# Altium project PCB_Project_GateWay.PrjPcb
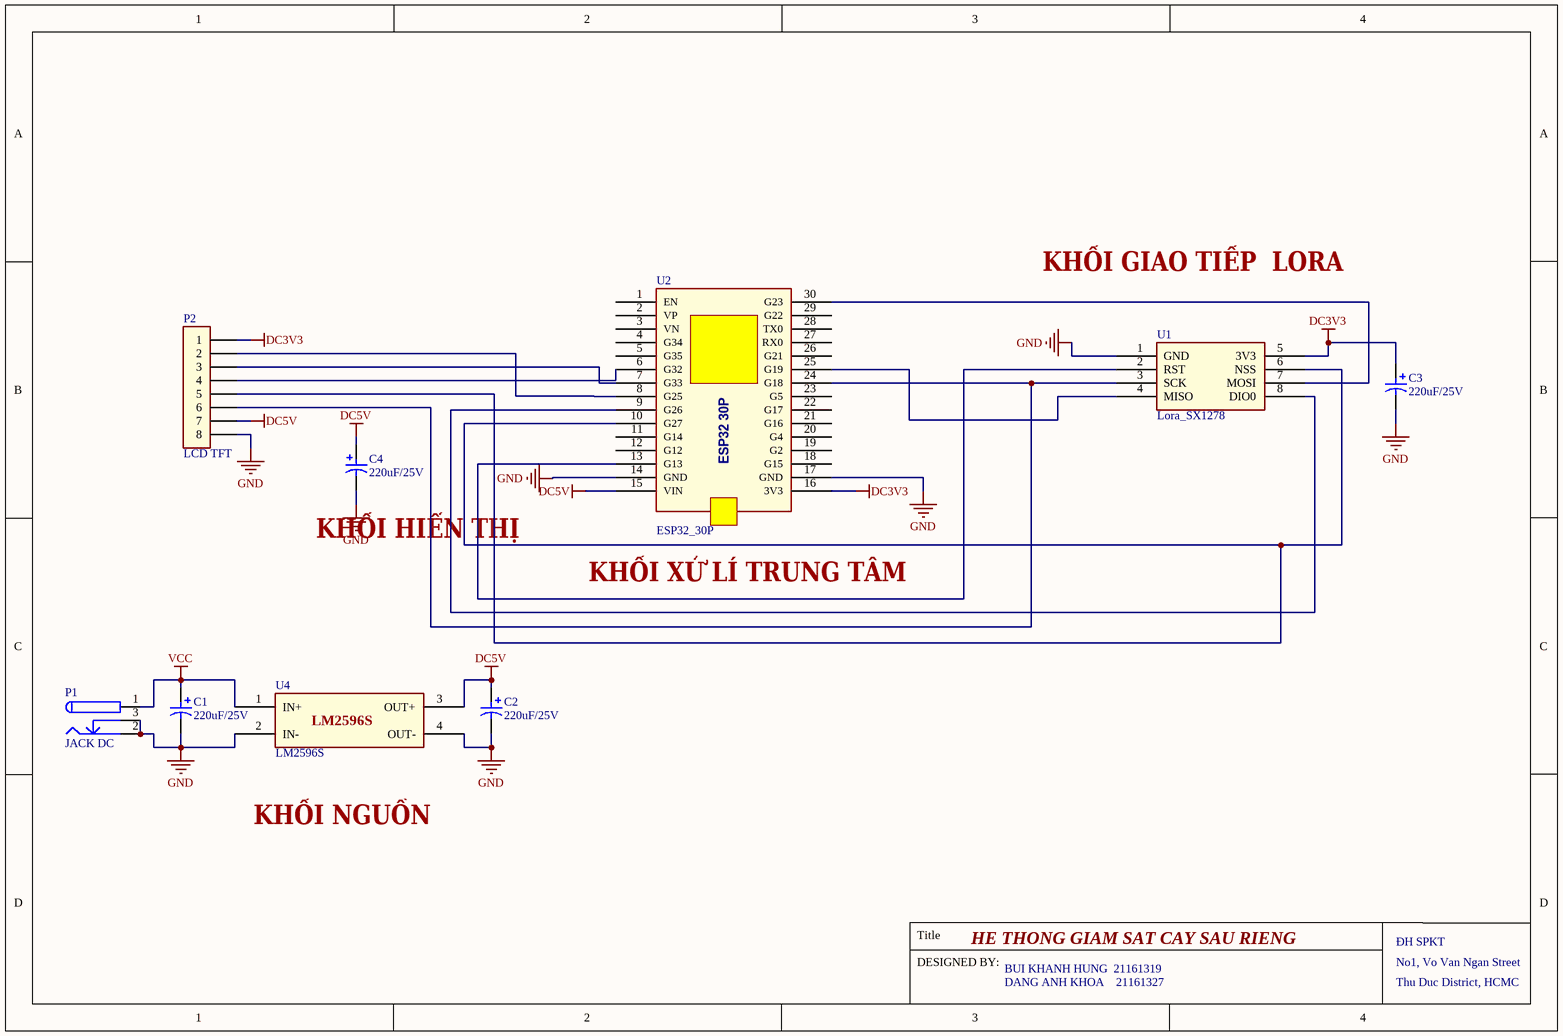
[diagram p0: Schematic.SchDoc]
1 sheet, 9 parts. Net scope: global (net labels, ports and power ports of the same name join across sheets).
Board file: PCB1.PcbDoc

## Sheet Schematic.SchDoc
size A4; Organization: Altium Limited; Address1: L3, 12a Rodborough Rd; Address2: Frenchs Forest; Address3: NSW; Address4: Australia 2086; SheetNumber: 1; SheetTotal: 1

### Parts
C1  220uF/25V  [CAP-ALUM-10x12.5]
C2  220uF/25V  [CAP-ALUM-10x12.5]
C3  220uF/25V  [CAP-ALUM-10x12.5]
C4  220uF/25V  [CAP-ALUM-10x12.5]
P1  JACK DC  [DC5.5/2.1]
P2  LCD TFT  [B8B-XH-A]
U1  Lora_SX1278  [Module-LORA-SX1278]
U2  ESP32_30P  [Kit-ESP32-30P]
U4  LM2596S  [Module-LM2596S]

### Nets
DC3V3: C3.1 P2.1 U1.5(3V3) U2.16(3V3)
DC5V: C2.1 C4.1 P2.7 U2.15(VIN) U4.3(OUT+)
GND: C1.2 C2.2 C3.2 C4.2 P1.2 P1.3 P2.8 U1.1(GND) U2.14(GND) U2.17(GND) U4.2(IN-) U4.4(OUT-)
VCC: C1.1 P1.1 U4.1(IN+)
NetP2_2: P2.2 U2.8(G25)
NetP2_3: P2.3 U2.7(G33)
NetP2_4: P2.4 U2.6(G32)
NetP2_5: P2.5 U1.6(NSS) U2.10(G27)
NetP2_6: P2.6 U1.3(SCK) U2.24(G18)
NetU1_2: U1.2(RST) U2.13(G13)
NetU1_4: U1.4(MISO) U2.25(G19)
NetU1_7: U1.7(MOSI) U2.30(G23)
NetU1_8: U1.8(DIO0) U2.9(G26)

Not connected (* = marked no-connect by the designer): U2 1(EN) 2(VP) 3(VN) 4(G34) 5(G35) 11(G14) 12(G12) 18(G15) 19(G2) 20(G4) 21(G16) 22(G17) 23(G5) 26(G21) 27(RX0) 28(TX0) 29(G22)

### Notes on the sheet
- KHỐI GIAO TIẾP  LORA
- KHỐI HIỂN THỊ
- KHỐI XỬ LÍ TRUNG TÂM
- KHỐI NGUỒN
- Title
- DESIGNED BY:
- HE THONG GIAM SAT CAY SAU RIENG
- BUI KHANH HUNG  21161319
- DANG ANH KHOA    21161327
- ĐH SPKT
- No1, Vo Van Ngan Street
- Thu Duc District, HCMC
- (in symbol Kit_ESP32_30P) ESP32 30P

### Library data of the parts
C1-C4 = EEUTA1E221: Capacitor Aluminum 220uF 20% 25V Radial; MPN: CLA4514; Solder: WAVE; Value: 220uF/25V; Category: CAPACITOR; MFR_URL: http://linhkienchatluong.vn/tu-hoa-chat-luong-cao/tu-hoa-63v-47uf-nipponlelon-8x11mm_sp977_ct6500.aspx; PinCount: 2
P1 = DC5.5/2.1: Low Voltage Power Supply Connector; Value: JACK DC
P2 = B8B-XH-A: Connector Header Through Hole 8 position 0.098" (2.50mm); Value: B8B-XH-A
U1 = Module-Lora-SX1278-SPI: Module Lora SX1278 RA02 SPI; Value: Lora_SX1278
U2 = Kit_ESP32_30P: Kit ESP32 30P; Value: ESP32_30P
U4 = Module-LM2596S: Module LM2596S; Value: LM2596S